# Altium schematic sheet DetectionSch.SchDoc: Detection Section Schematics
size A; DrawnBy: Enrique Morell; DocumentNumber: 2; Revision: v0.1; SheetNumber: 2; SheetTotal: 9
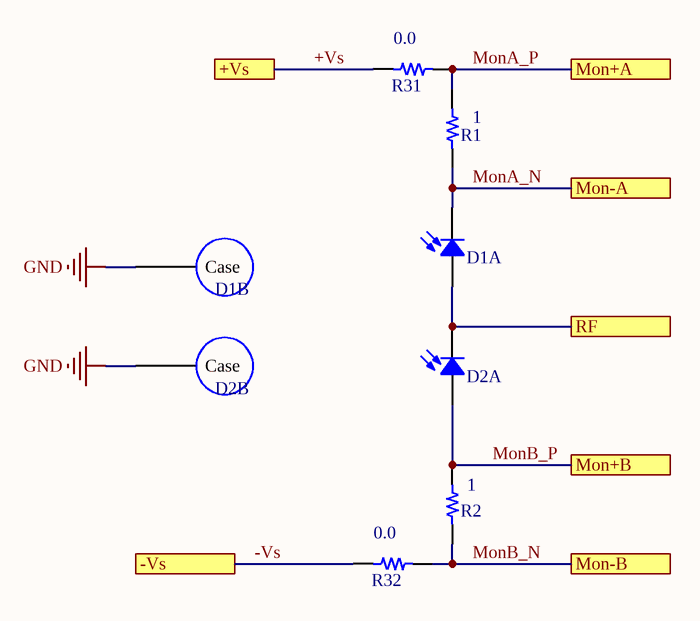
[diagram p0: DetectionSch.SchDoc]

## Parts
D1  S5973-02  [TO-18]  (value not drawn)  (parts A,B of 2)
D2  S5973-02  [TO-18]  (value not drawn)  (parts A,B of 2)
R1  1  [STACKPOLE CSR1206]
R2  1  [STACKPOLE CSR1206]
R31  0.0  [RES 0402/1005]
R32  0.0  [RES 0402/1005]

## Ports
+Vs, -Vs, Mon+A, Mon+B, Mon-A, Mon-B, RF

## Nets
GND: D1.2(Case) D2.2(Case)
+Vs: R31.1 ; port +Vs
-Vs: R32.1 ; port -Vs
MonA_N: D1.1 R1.2 ; port Mon-A
MonA_P: R1.1 R31.2 ; port Mon+A
MonB_N: R2.1 R32.2 ; port Mon-B
MonB_P: D2.3 R2.2 ; port Mon+B
RF: D1.3 D2.1 ; port RF

## Library data of the parts
D1 D2 = S5973-02: The S5973-02 is a high-speed Si PIN photodiode des; Manufacturer: Hamamatsu; Value: Green; Type: Through-Hole; Colour: Silver; PartId: 10872; Part Number: S5973-02; Supplier 1: Hamamatsu; Supplier Part Number 1: S5973-02; ComponentLink1Description: Datasheet; ComponentLink1URL: https://www.hamamatsu.com/resources/pdf/ssd/s5971_etc_kpin1025e.pdf; ComponentLink2Description: Hamamatsu Listing; ComponentLink2URL: https://www.hamamatsu.com/us/en/product/type/S5973-02/index.html; Price: 32; Device Package: TO-18
R1 R2 = CSR1206FK1R00: RES SMD 1 OHM 1% 1/2W 1206; Manufacturer: Stackpole Electronics Inc.; TemperatureRange: -55C ~ 155C; TemperatureCoefficient: 100ppm/C; PowerRating: 0.5W, 1/2W; Value: 1; PartId: 9988; Part Number: CSR1206FK1R00; Supplier 1: Digi-Key; Supplier Part Number 1: CSR1206FK1R00TR-ND; ComponentLink1Description: Datasheet; ComponentLink1URL: http://www.seielect.com/catalog/SEI-CSR_CSRN.pdf; ComponentLink2Description: Digi-Key Listing; ComponentLink2URL: https://www.digikey.com/product-detail/en/stackpole-electronics-inc/CSR1206FK1R00/CSR1206FK1R00TR-ND/1742410; Tolerance: 1%; Price: 0.051; Device Package: 1206 (3216 Metric)
R31 R32 = ERJ-2GE0R00X: RES SMD 0.0OHM JUMPER 1/10W 0402; Manufacturer: Panasonic Electronic Components; TemperatureRange: -55C ~ 155C; PowerRating: 0.1W, 1/10W; Value: 0.0; Part Number: ERJ-2GE0R00X; PartId: 16129; Supplier 1: Digi-Key; Supplier Part Number 1: P0.0JTR-ND; ComponentLink1Description: Datasheet; ComponentLink1URL: http://industrial.panasonic.com/www-cgi/jvcr13pz.cgi?E+PZ+3+AOA0001+ERJ2GE0R00X+7+WW; ComponentLink2Description: Digi-Key Listing; ComponentLink2URL: https://www.digikey.com/product-detail/en/panasonic-electronic-components/ERJ-2GE0R00X/P0.0JTR-ND/146727; Tolerance: Jumper; Price: 0.0029; Device Package: 0402 (1005 Metric)